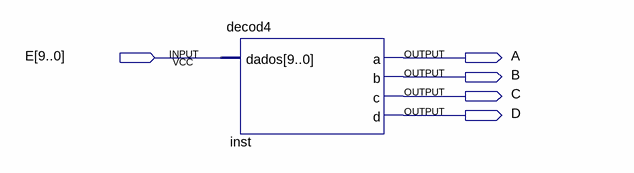
[diagram p0: schematic sheet]
// Quartus schematic Pre1.bdf as structural Verilog: 1 symbols, 5 pins
module Pre1 (
  input  [9:0] E,
  output A,
  output B,
  output C,
  output D
);

  decod4 inst (.dados(E), .a(A), .b(B), .c(C), .d(D));
endmodule
